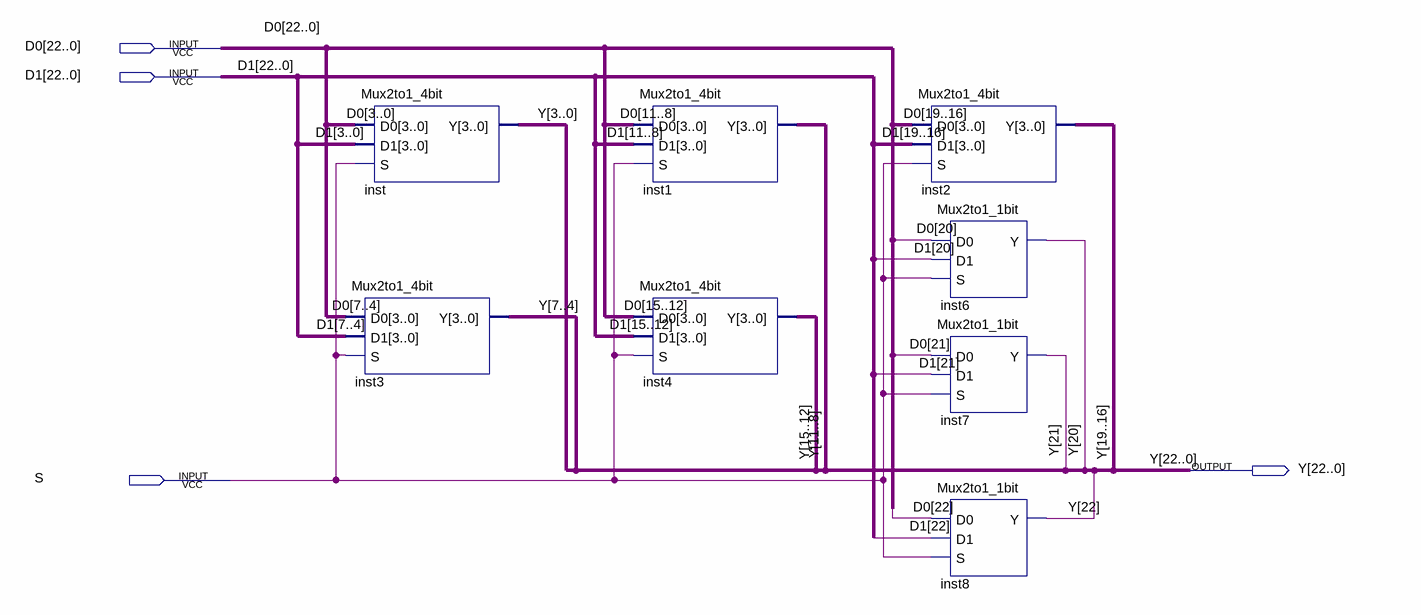
[diagram p0: schematic sheet]
// Quartus schematic Mux2to1_24bit.bdf as structural Verilog: 8 symbols, 4 pins
module Mux2to1_24bit (
  input  [22:0] D0,
  input  [22:0] D1,
  input  S,
  output [22:0] Y
);

  Mux2to1_4bit inst (.D0(D0[3:0]), .D1(D1[3:0]), .S(S), .Y(Y[3:0]));
  Mux2to1_4bit inst3 (.D0(D0[7:4]), .D1(D1[7:4]), .S(S), .Y(Y[7:4]));
  Mux2to1_4bit inst1 (.D0(D0[11:8]), .D1(D1[11:8]), .S(S), .Y(Y[11:8]));
  Mux2to1_4bit inst4 (.D0(D0[15:12]), .D1(D1[15:12]), .S(S), .Y(Y[15:12]));
  Mux2to1_4bit inst2 (.D0(D0[19:16]), .D1(D1[19:16]), .S(S), .Y(Y[19:16]));
  Mux2to1_1bit inst6 (.D0(D0[20]), .D1(D1[20]), .S(S), .Y(Y[20]));
  Mux2to1_1bit inst7 (.D0(D0[21]), .D1(D1[21]), .S(S), .Y(Y[21]));
  Mux2to1_1bit inst8 (.D0(D0[22]), .D1(D1[22]), .S(S), .Y(Y[22]));
endmodule
